# EAGLE design Pi1541_IEC (EAGLE 9.2.2)
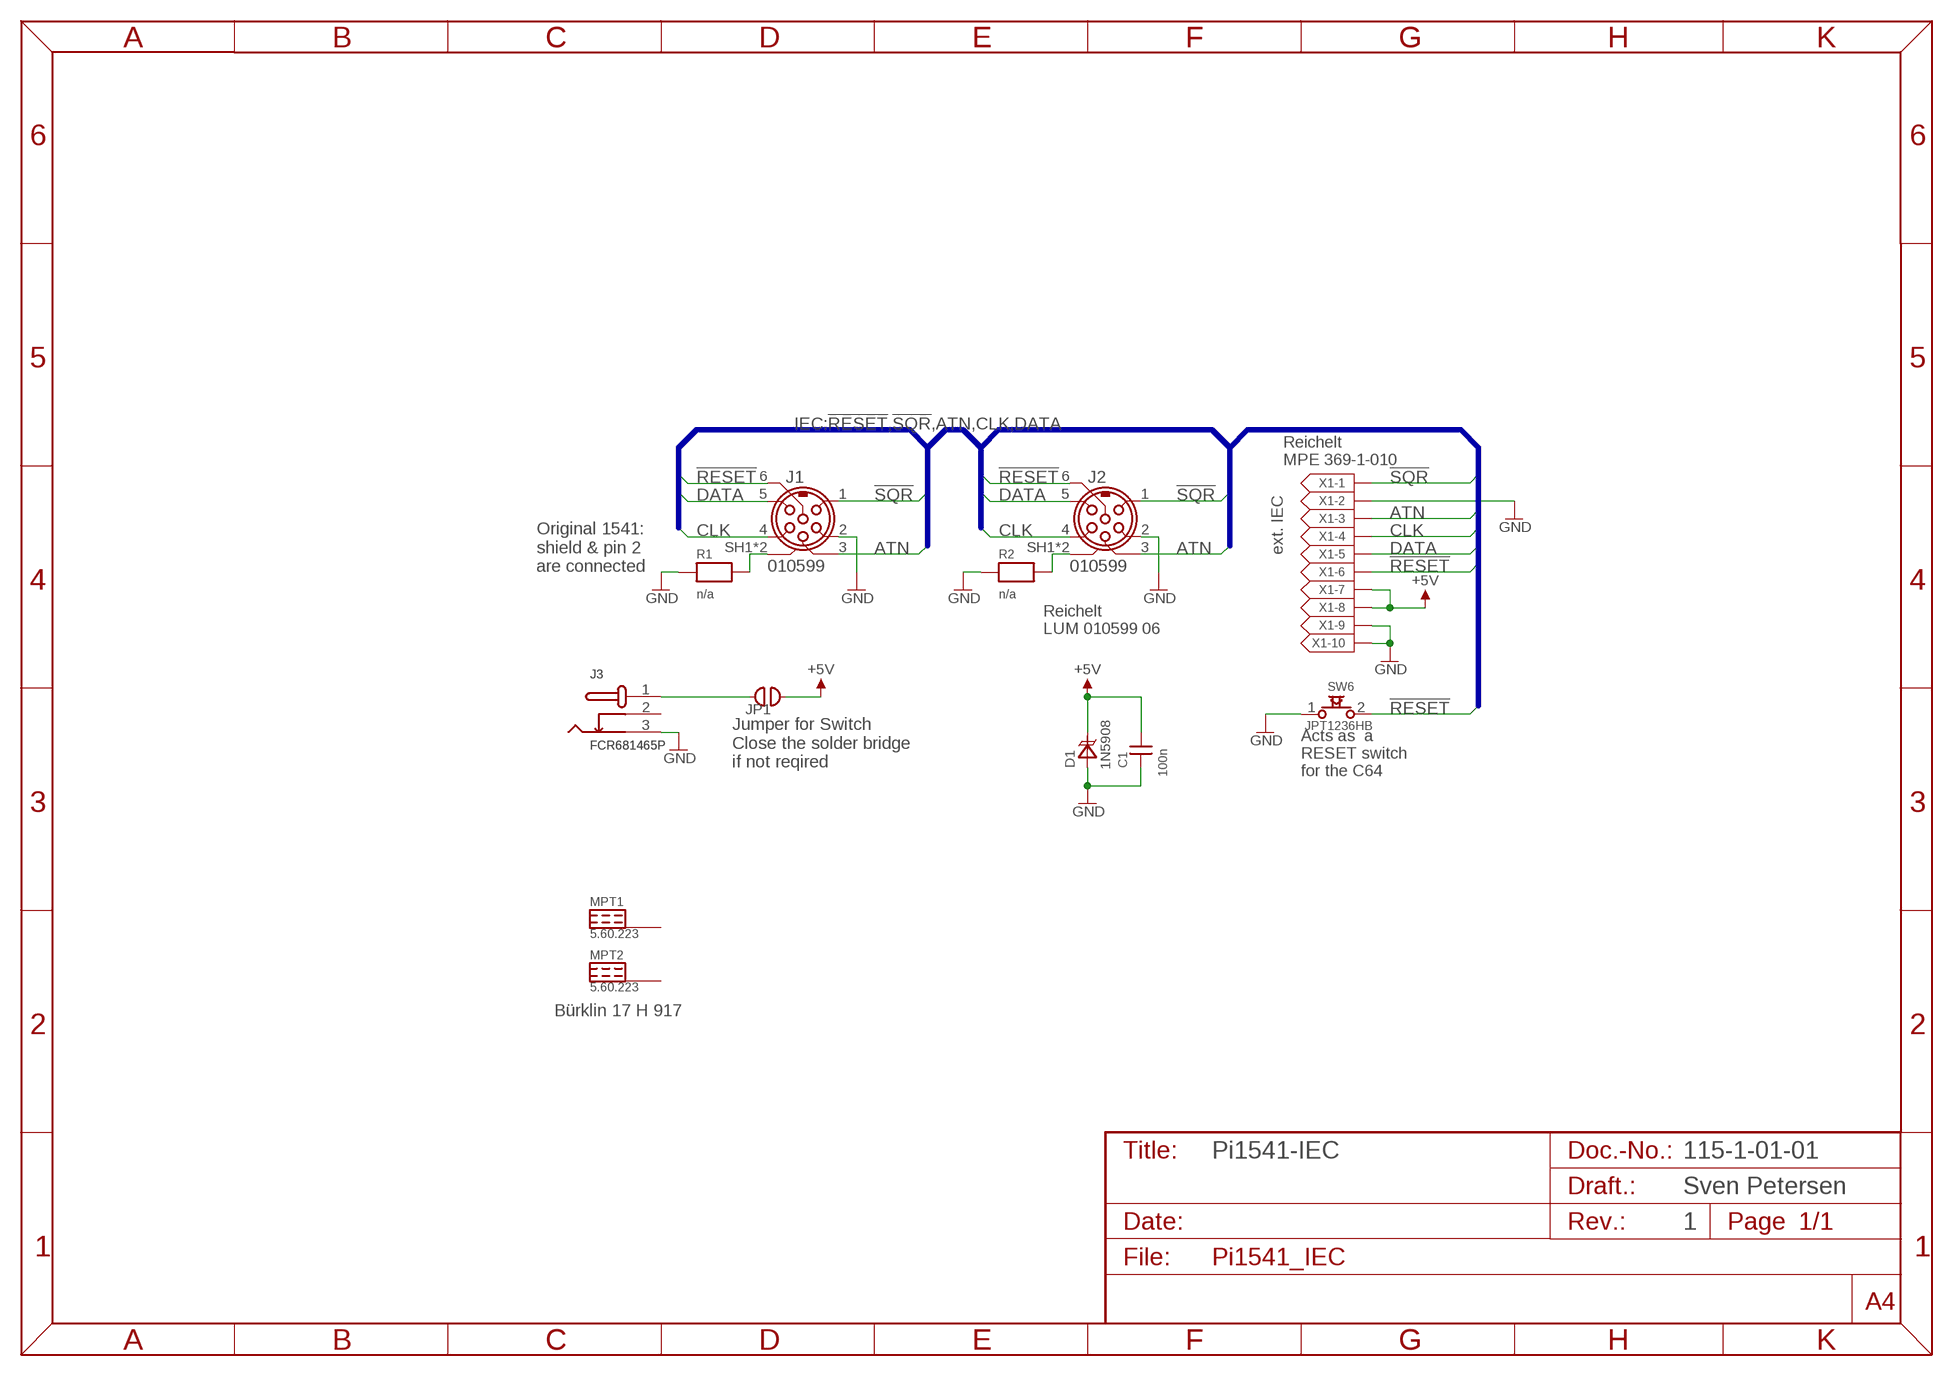
[diagram p0: schematic, sheet 1]

## Parts
C1  100n  CAP01  [C-2,5]
D1  1N5908  [CB429]
J1  010599  [010599]
J2  010599  [010599]
J3  FCR681465P  [FCR681465P]
JP1  COMBI_2P  [COMBI-2P]
MPT1  5.60.223  [5.60.223]
MPT2  5.60.223  [5.60.223]
R1  n/a  R-0805  [0805]
R2  n/a  R-0805  [0805]
SW6  JPT1236HB  [JTP_1236HB]
X1  369-1-010  MICMA10B-THT  [MICMA10B]

## Nets
!RESET: J1.6 J2.6 SW6.2 X1.6
!SQR: J1.1 J2.1 X1.1
+5V: C1.2 D1.K JP1.2 X1.7 X1.8
ATN: J1.3 J2.3 X1.3
CLK: J1.4 J2.4 X1.4
DATA: J1.5 J2.5 X1.5
GND: C1.1 D1.A J1.2 J2.2 J3.3 R1.1 R2.1 SW6.1 X1.2 X1.9 X1.10
N$1: J1.SH1(SH) J1.SH2(SH) R1.2
N$2: J2.SH1(SH) J2.SH2(SH) R2.2
N$3: J3.1 JP1.1
Unconnected: J3.2 MPT1.1 MPT2.1

## Buses
IEC:!RESET,!SQR,ATN,CLK,DATA

## Notes on the sheet
- Reichelt
  MPE 369-1-010
- ext. IEC
- Original 1541:
  shield & pin 2 
  are connected
- Reichelt
  LUM 010599 06
- Jumper for Switch
  Close the solder bridge
  if not reqired
- Acts as  a
  RESET switch
  for the C64
- Bürklin 17 H 917
- Pi1541-IEC | 115-1-01-01
- Sven Petersen
- 1

## Library data of the parts
C1 = DISCRETE:CAP01
D1 = ST:1N5908
J1 J2 = Lumberg:010599
J3 = Cliff:FCR681465P
JP1 = Cutpad:COMBI_2P
MPT1 MPT2 = Ettinger:5.60.223
R1 R2 = SMD:R-0805
SW6 = Namae_Electronics:JPT1236HB
X1 = AMP:MICMA10B

## Board
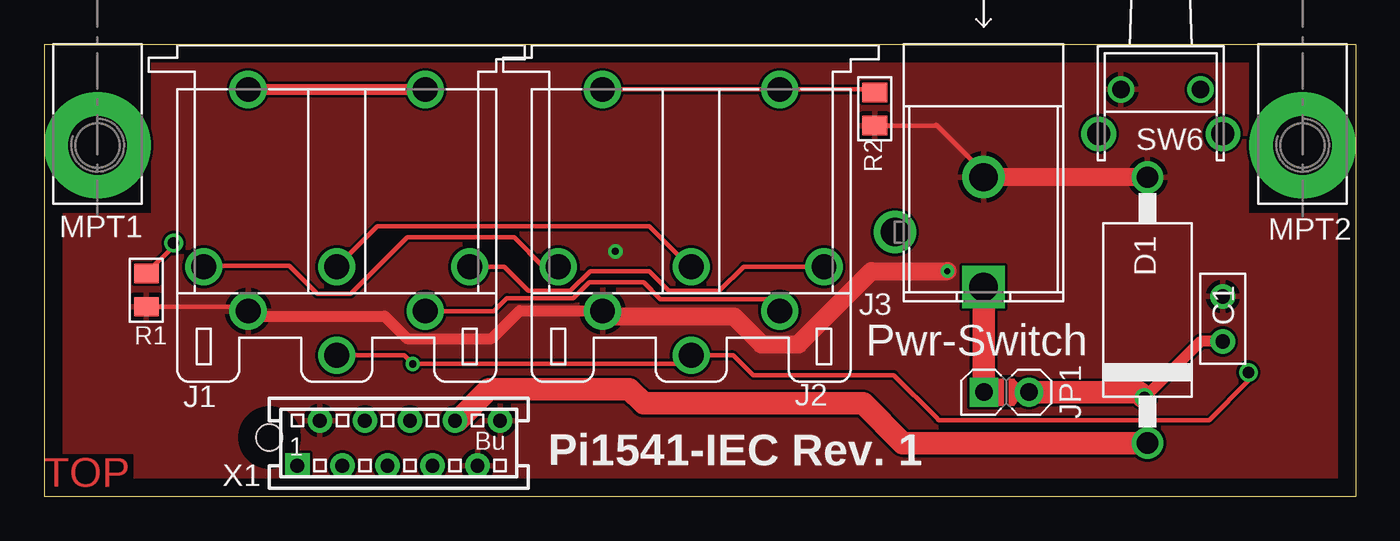
[diagram p1: board, top side]
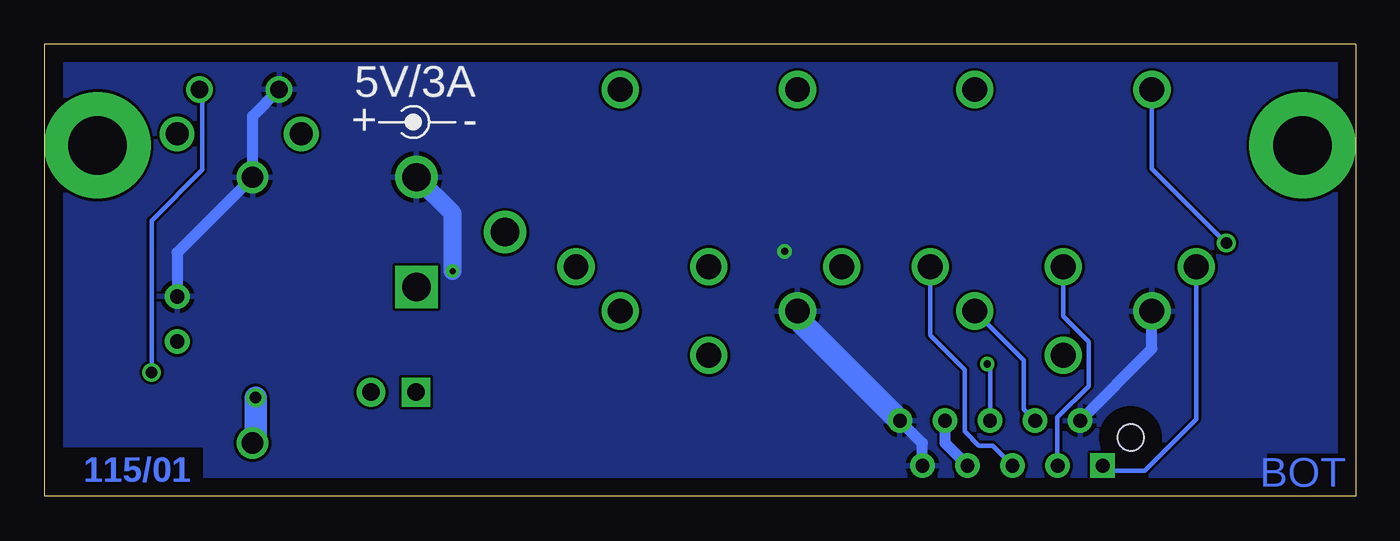
[diagram p2: board, bottom side, seen from below]

Size 74 x 25.5 mm. Coordinates in mm from the lower left corner, seen from the top.
Outline: 0,0 74,0 74,25.5 0,25.5 0,0
Copper layers (1*16): Top 0.035mm / dielectric 1.5mm / Bottom 0.035mm
Design rules "default": minimum track width 6mil, minimum drill 0.35mm, track to track 6mil, track to pad 6mil, pad to pad 6mil, via to via 6mil, smd to smd 6mil, copper to edge 40mil, drill to drill 6mil, minimum pad ring 10mil, minimum via ring 8mil, stop-mask expansion 4mil, vias tented up to drill 0mil, thermal gap 10mil
bRestrict: 2 lines

### Footprints (pad centres in the part's own frame; a part is rotated, then mirrored left to right if it is on the bottom)
C-2,5 = drill 0.8 pad 1.397: 1 -1.27,0; 2 1.27,0
CB429 = drill 1.2: A -7.5,0; K 7.5,0
010599 = drill 1.4: 1 10,-7.5; 2 12.5,-5; 3 10,0; 4 12.5,5; 5 10,7.5; 6 15,0; SH1 0,5; SH2 0,-5
FCR681465P = drill 1.6 square: 1 0,13.7 | drill 1.6: 2 5,10.6; 3 0,7.5
COMBI-2P = drill 1 pad 1.626 square: 1 -1.27,0 | drill 1 pad 1.626: 2 1.27,0
5.60.223 = drill 3.3 pad 6: 1 0,-5.7
0805 = smd 1.092 x 1.397: 1 -0.94,0; 2 0.94,0
JTP_1236HB = drill 1: 1 2.25,0; 2 -2.25,0 | drill 1.3: CS1 3.5,2.5; CS2 -3.5,2.5
MICMA10B = drill 0.787 pad 1.397 square: 1 5.715,1.27 | drill 0.787 pad 1.397: 2 4.445,-1.27; 3 3.175,1.27; 4 1.905,-1.27; 5 0.635,1.27; 6 -0.635,-1.27; 7 -1.905,1.27; 8 -3.175,-1.27; 9 -4.445,1.27; 10 -5.715,-1.27 | hole 1.499: 7.303,-0.318

### Placement (x,y rotation side)
C1  66.5,10 270 top
D1  62.25,10.5 270 top
J1  16.5,22.95 270 top
J2  36.5,22.95 270 top
J3  53,25.5 180 top
JP1  54.29,5.87 0 top
MPT1  3,25.5 0 top
MPT2  71,25.5 0 top
R1  5.76,11.63 90 top
R2  46.86,21.85 90 top
SW6  63,22.95 180 top
U$44  [2LAYER]  4.83,2.2 180 top
U$45  [PCB-TITLE/]  0,51.02 0 top  (outside the outline)
X1  20,3 180 top

### Tracks (layer width: path | path; a pad name or v marks a point on that pad's centre or on a via)
!RESET  (via drill 0.4, 0.65)
  Top 0.254: J1.6 20.31,7.95 v20.8,7.46 36.02,7.47 J2.6 38.72,7.95 38.88,7.95 40.01,6.83 47.94,6.83 50.32,4.45 50.48,4.29 65.72,4.29 67.94,6.51 v67.94,6.99
  Bottom 0.254: v67.94,6.99 67.94,15.56 65.09,18.41 65.09,22.79 SW6.2 | v20.8,7.46 20.64,7.3 X1.6
!SQR
  Top 0.254: J2.1 28.17,12.95 26.51,14.61 20.48,14.61 17.3,11.43 15.4,11.43 13.81,13.02 9.07,13.02 J1.1
  Bottom 0.254: J1.1 9,4.34 11.91,1.43 13.98,1.43 X1.1
+5V  (via drill 0.65)
  Top 0.61: C1.2 65.25,8.73 v62.07,5.56
  Top 1.27: X1.8 23.32,4.27 25.08,6.03 33.02,6.03 33.81,5.24 46.2,5.24 48.44,3 D1.K | v62.07,5.56 61.75,5.87 JP1.2
  Bottom 0.61: X1.7 23.18,3 X1.8
  Bottom 1.27: v62.07,5.56 62.07,3.18 D1.K
ATN
  Top 0.254: J1.3 18.79,15.24 34.13,15.24 36.42,12.95 J2.3
  Bottom 0.254: J1.3 16.5,10.15 15.06,8.71 15.06,6.21 16.83,4.45 16.83,2.06 X1.3
CLK
  Top 0.254: J1.4 25.37,10.45 26.11,11.18 29.86,11.18 30.74,12.06 33.81,12.06 34.77,11.11 40.84,11.11 | 40.84,11.11 41.06,10.89 | 41.06,10.89 J2.4 | 40.84,11.11 41.06,10.89
  Bottom 0.254: X1.4 18.73,4.91 18.73,7.68 J1.4
DATA
  Top 0.254: J1.5 25.94,12.95 27.3,11.59 29.69,11.59 30.8,12.7 34.13,12.7 35.24,11.59 38.1,11.59 39.46,12.95 J2.5
  Bottom 0.254: X1.5 20.49,2.86 21.27,2.86 22.07,3.65 22.07,7.14 24,9.08 J1.5
GND  (via drill 0.35, 0.4)
  Top 0.254: R1.1 11.26,10.69 J1.2 | R2.1 50.28,20.91 50.32,20.95 53,18.28 J3.3
  Top 0.61: J1.2 11.79,10.16 19.21,10.16 20.48,8.89 25.24,8.89 26.83,10.48 31.47,10.48 J2.2
  Top 1.016: J2.2 31.82,10.13 38.92,10.13 40.48,8.57 42.55,8.57 46.67,12.7 v50.96,12.7 | D1.A J3.3
  Bottom 0.61: SW6.1 62.25,21.45 D1.A 66.5,13.75 C1.1 | X1.9 24.45,3 X1.10 | X1.2 11.5,8.32 J1.2
  Bottom 1.016: v50.96,12.7 50.96,15.96 J3.3
  Bottom 1.27: X1.10 31.5,10.05 J2.2
  other vias: 32.23,13.81
  pour Top: 0.48,25.02 0.48,0.48 73.06,0.48 73.06,25.02
  pour Bottom: 0.48,25.02 73.06,25.02 73.06,0.48 0.48,0.48
N$1  (via drill 0.65)
  Top 0.254: R1.2 7.3,14.11 v7.3,14.29
  Top 0.61: J1.SH2 J1.SH1
  Bottom 0.254: v7.3,14.29 11.5,18.48 J1.SH2
N$2
  Top 0.254: J2.SH2 J2.SH1 46.92,22.95 | 46.92,22.95 46.99,23.02 | 46.92,22.95 46.86,22.89 R2.2
N$3
  Top 1.27: JP1.1 53.02,11.78 J3.1

### Text on the board
Bottom: 115/01
tPlace: Pwr-Switch | Pi1541-IEC Rev. 1
bPlace: 5V/3A | - | +
Document: 115-2-01-01 | Sven Petersen / 2019 | 35µm | 2 | 1